# Altium schematic sheet v6_io_34_35_36_37_38.SchDoc: Virtex-6 IO Banks 34, 35,36,37 & 38
size A3; Date: DO NOT USE, RATHER USE PROJ OPTIONS; DrawnBy: DO NOT USE, RATHER USE PROJ OPTIONS; Engineer: DO NOT USE, RATHER USE PROJ OPTIONS; Organization: DO NOT USE, RATHER USE PROJ OPTIONS; DocumentNumber: DO NOT USE, RATHER USE PROJ OPTIONS; Revision: DO NOT USE, RATHER USE PROJ OPTIONS; SheetNumber: 17; SheetTotal: 27; SCH_Sheet_Filename: v6_io_34_35_36_37_38.SchDoc; CurrentTime: DO NOT USE, RATHER USE PROJ OPTIONS; Time: DO NOT USE, RATHER USE PROJ OPTIONS; DocumentFullPathAndName: DO NOT USE, RATHER USE PROJ OPTIONS; DocumentName: DO NOT USE, RATHER USE PROJ OPTIONS; ModifiedDate: DO NOT USE, RATHER USE PROJ OPTIONS; ImagePath: DO NOT USE, RATHER USE PROJ OPTIONS
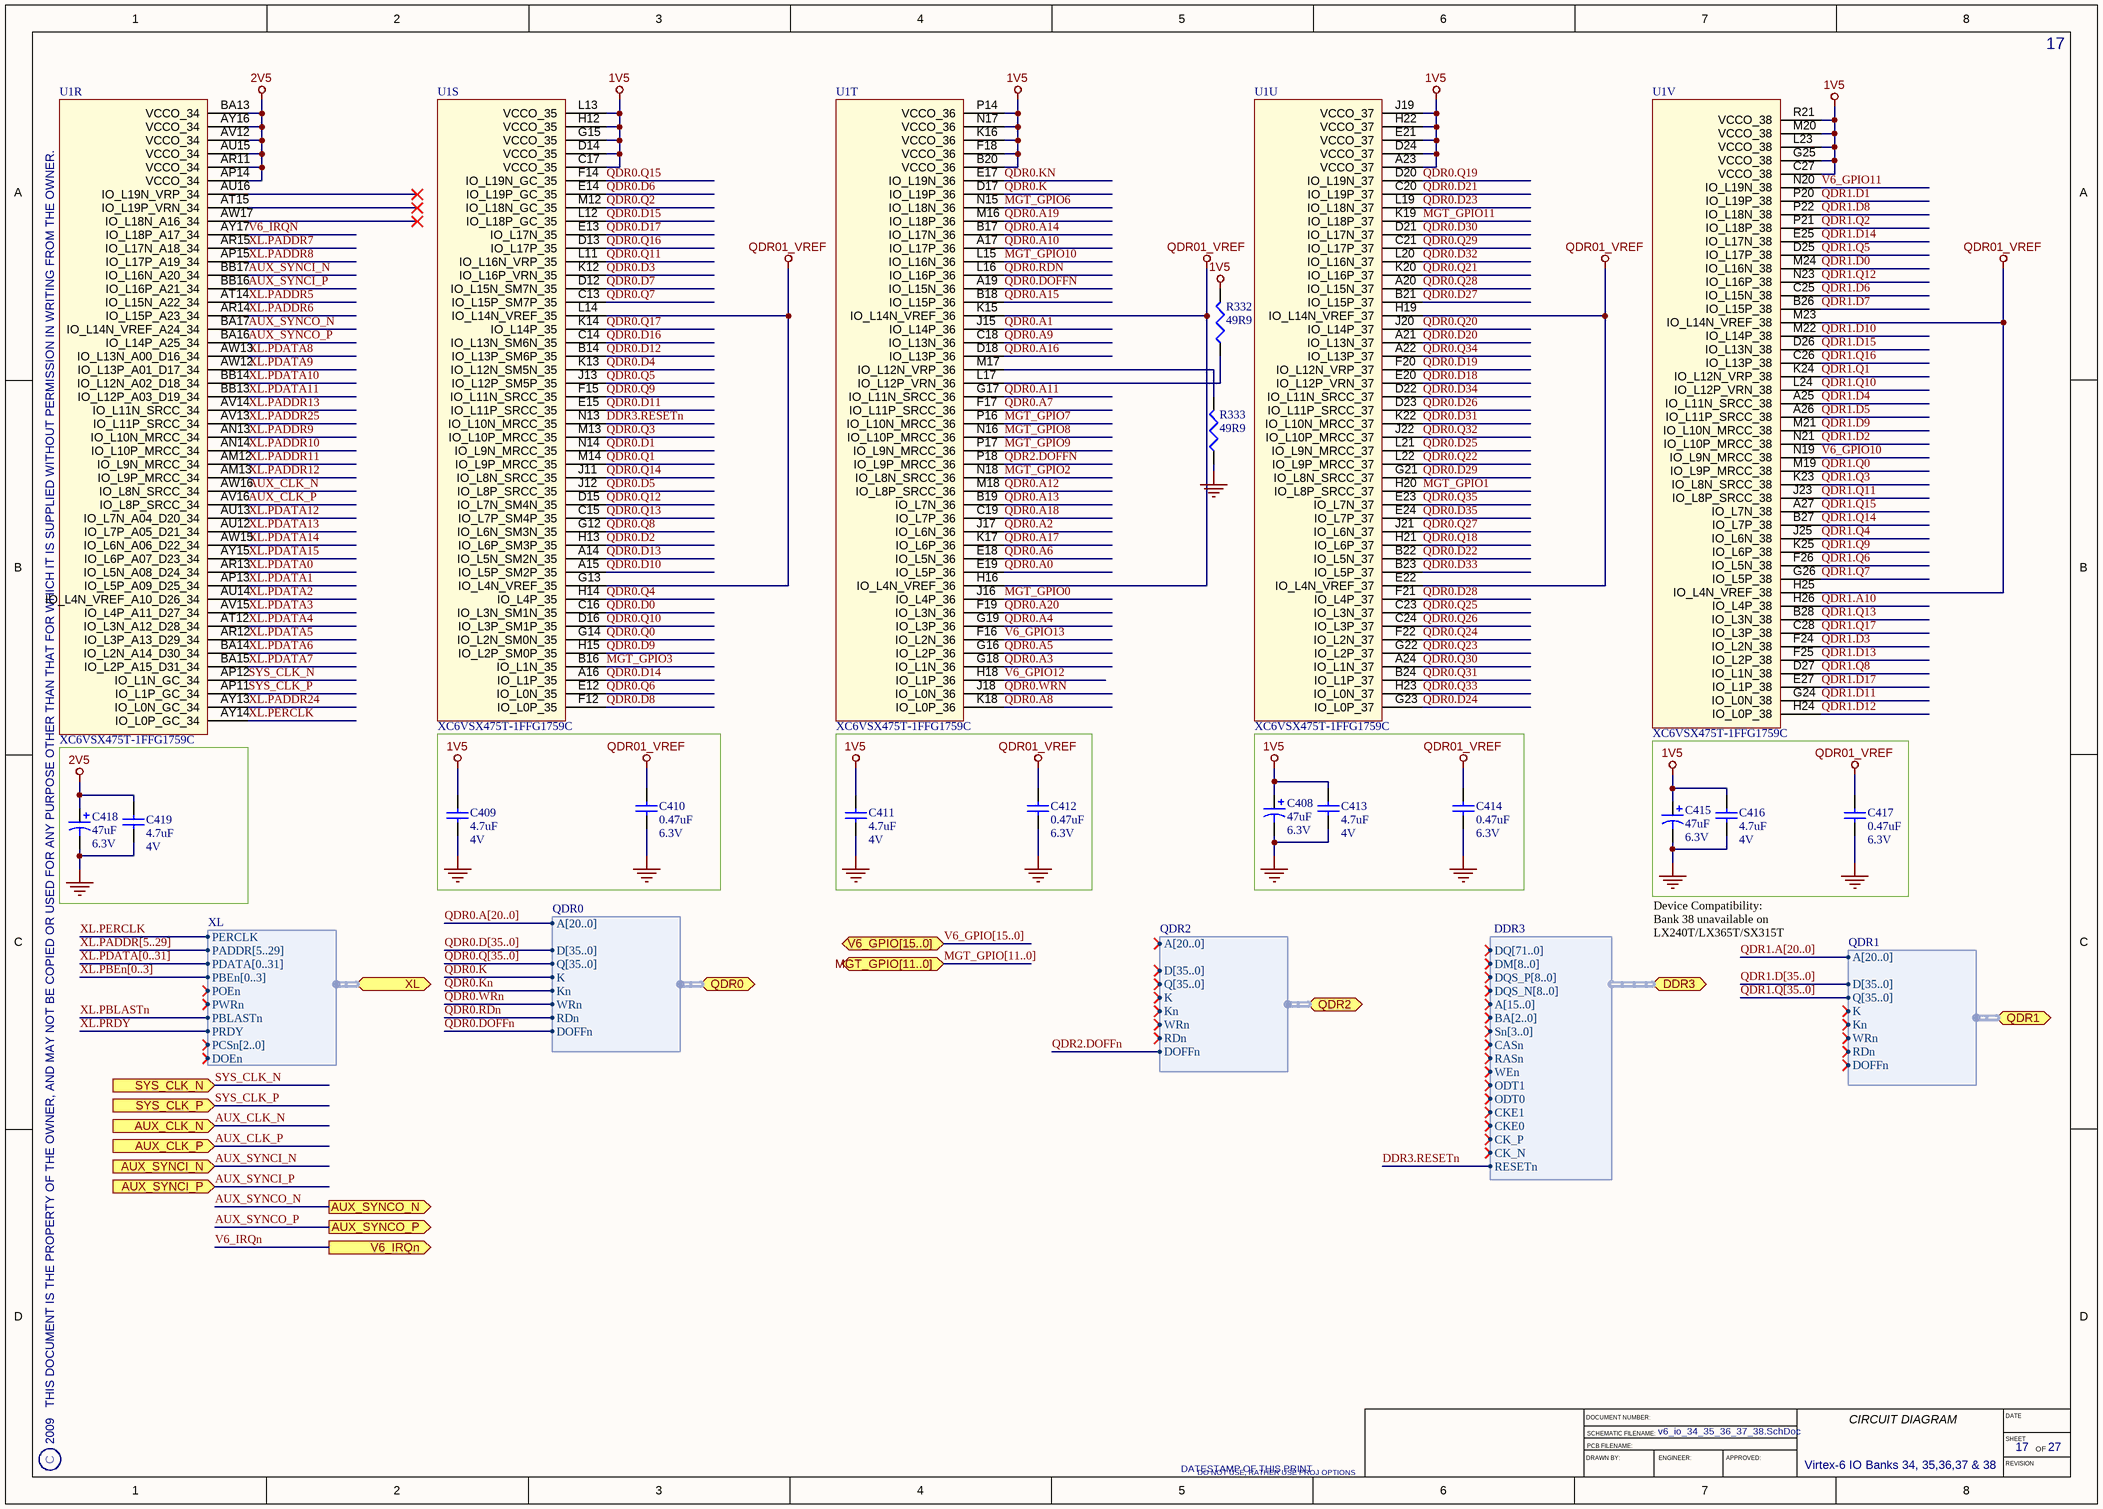
[diagram p0: v6_io_34_35_36_37_38.SchDoc]

## Parts
C408  Rating: 6.3V  [CAPMP3528X120L]  (hidden comment: 47uF)
C409  Rating: 4V  [CAPC1005X60L]  (hidden comment: 4.7uF)
C410  Rating: 6.3V  [CAPC1005X55L]  (hidden comment: 0.47uF)
C411  Rating: 4V  [CAPC1005X60L]  (hidden comment: 4.7uF)
C412  Rating: 6.3V  [CAPC1005X55L]  (hidden comment: 0.47uF)
C413  Rating: 4V  [CAPC1005X60L]  (hidden comment: 4.7uF)
C414  Rating: 6.3V  [CAPC1005X55L]  (hidden comment: 0.47uF)
C415  Rating: 6.3V  [CAPMP3528X120L]  (hidden comment: 47uF)
C416  Rating: 4V  [CAPC1005X60L]  (hidden comment: 4.7uF)
C417  Rating: 6.3V  [CAPC1005X55L]  (hidden comment: 0.47uF)
C418  Rating: 6.3V  [CAPMP3528X120L]  (hidden comment: 47uF)
C419  Rating: 4V  [CAPC1005X60L]  (hidden comment: 4.7uF)
R332  49R9  [RESC1005X40L]
R333  49R9  [RESC1005X40L]
U1  XC6VSX475T-1FFG1759C  [FFG1759]  (parts R,S,T,U,V of 39)

## Ports
AUX_CLK_N (in), AUX_CLK_P (in), AUX_SYNCI_N (in), AUX_SYNCI_P (in), AUX_SYNCO_N (out), AUX_SYNCO_P (out), DDR3 (harness DDR3), MGT_GPIO[11..0] (bidir), QDR0 (harness QDR0), QDR1 (harness QDR1), QDR2 (harness QDR2), SYS_CLK_N (in), SYS_CLK_P (in), V6_GPIO[15..0] (bidir), V6_IRQn (out), XL (harness XL)

## Harnesses
DDR3: DQ[71..0], DM[8..0], DQS_P[8..0], DQS_N[8..0], A[15..0], BA[2..0], Sn[3..0], CASn, RASn, WEn, ODT1, ODT0, CKE1, CKE0, CK_P, CK_N, RESETn
QDR0: A[20..0], D[35..0], Q[35..0], K, Kn, WRn, RDn, DOFFn
QDR2: A[20..0], D[35..0], Q[35..0], K, Kn, WRn, RDn, DOFFn
QDR1: A[20..0], D[35..0], Q[35..0], K, Kn, WRn, RDn, DOFFn
XL: PERCLK, PADDR[5..29], PDATA[0..31], PBEn[0..3], POEn, PWRn, PBLASTn, PRDY, PCSn[2..0], DOEn

## Nets
1V5: C408.1 C409.2 C411.2 C413.2 C415.1 C416.2 R332.2 U1.A23(VCCO_37) U1.B20(VCCO_36) U1.C17(VCCO_35) U1.C27(VCCO_38) U1.D14(VCCO_35) U1.D24(VCCO_37) U1.E21(VCCO_37) U1.F18(VCCO_36) U1.G15(VCCO_35) U1.G25(VCCO_38) U1.H12(VCCO_35) U1.H22(VCCO_37) U1.J19(VCCO_37) U1.K16(VCCO_36) U1.L13(VCCO_35) U1.L23(VCCO_38) U1.M20(VCCO_38) U1.N17(VCCO_36) U1.P14(VCCO_36) U1.R21(VCCO_38)
2V5: C418.1 C419.2 U1.AP14(VCCO_34) U1.AR11(VCCO_34) U1.AU15(VCCO_34) U1.AV12(VCCO_34) U1.AY16(VCCO_34) U1.BA13(VCCO_34)
GND: C408.2 C409.1 C410.1 C411.1 C412.1 C413.1 C414.1 C415.2 C416.1 C417.1 C418.2 C419.1 R333.1
QDR01_VREF: C410.2 C412.2 C414.2 C417.2 U1.E22(IO_L4N_VREF_37) U1.G13(IO_L4N_VREF_35) U1.H16(IO_L4N_VREF_36) U1.H19(IO_L14N_VREF_37) U1.H25(IO_L4N_VREF_38) U1.K15(IO_L14N_VREF_36) U1.L14(IO_L14N_VREF_35) U1.M23(IO_L14N_VREF_38)
AUX_CLK_N: U1.AW16(IO_L8N_SRCC_34) ; port AUX_CLK_N
AUX_CLK_P: U1.AV16(IO_L8P_SRCC_34) ; port AUX_CLK_P
AUX_SYNCI_N: U1.BB17(IO_L16N_A20_34) ; port AUX_SYNCI_N
AUX_SYNCI_P: U1.BB16(IO_L16P_A21_34) ; port AUX_SYNCI_P
AUX_SYNCO_N: U1.BA17(IO_L14N_VREF_A24_34) ; port AUX_SYNCO_N
AUX_SYNCO_P: U1.BA16(IO_L14P_A25_34) ; port AUX_SYNCO_P
DDR3.RESETn: U1.N13(IO_L10N_MRCC_35) ; port DDR3.RESETn
MGT_GPIO0: U1.J16(IO_L4P_36)
MGT_GPIO1: U1.H20(IO_L8P_SRCC_37)
MGT_GPIO2: U1.N18(IO_L8N_SRCC_36)
MGT_GPIO3: U1.B16(IO_L1N_35)
MGT_GPIO6: U1.N15(IO_L18N_36)
MGT_GPIO7: U1.P16(IO_L10N_MRCC_36)
MGT_GPIO8: U1.N16(IO_L10P_MRCC_36)
MGT_GPIO9: U1.P17(IO_L9N_MRCC_36)
MGT_GPIO10: U1.L15(IO_L16N_36)
MGT_GPIO11: U1.K19(IO_L18P_37)
QDR0.A0: U1.E19(IO_L5P_36)
QDR0.A1: U1.J15(IO_L14P_36)
QDR0.A2: U1.J17(IO_L6N_36)
QDR0.A3: U1.G18(IO_L1N_36)
QDR0.A4: U1.G19(IO_L3P_36)
QDR0.A5: U1.G16(IO_L2P_36)
QDR0.A6: U1.E18(IO_L5N_36)
QDR0.A7: U1.F17(IO_L11P_SRCC_36)
QDR0.A8: U1.K18(IO_L0P_36)
QDR0.A9: U1.C18(IO_L13N_36)
QDR0.A10: U1.A17(IO_L17P_36)
QDR0.A11: U1.G17(IO_L11N_SRCC_36)
QDR0.A12: U1.M18(IO_L8P_SRCC_36)
QDR0.A13: U1.B19(IO_L7N_36)
QDR0.A14: U1.B17(IO_L17N_36)
QDR0.A15: U1.B18(IO_L15P_36)
QDR0.A16: U1.D18(IO_L13P_36)
QDR0.A17: U1.K17(IO_L6P_36)
QDR0.A18: U1.C19(IO_L7P_36)
QDR0.A19: U1.M16(IO_L18P_36)
QDR0.A20: U1.F19(IO_L3N_36)
QDR0.D0: U1.C16(IO_L3N_SM1N_35)
QDR0.D1: U1.N14(IO_L9N_MRCC_35)
QDR0.D2: U1.H13(IO_L6P_SM3P_35)
QDR0.D3: U1.K12(IO_L16P_VRN_35)
QDR0.D4: U1.K13(IO_L12N_SM5N_35)
QDR0.D5: U1.J12(IO_L8P_SRCC_35)
QDR0.D6: U1.E14(IO_L19P_GC_35)
QDR0.D7: U1.D12(IO_L15N_SM7N_35)
QDR0.D8: U1.F12(IO_L0P_35)
QDR0.D9: U1.H15(IO_L2P_SM0P_35)
QDR0.D10: U1.A15(IO_L5P_SM2P_35)
QDR0.D11: U1.E15(IO_L11P_SRCC_35)
QDR0.D12: U1.B14(IO_L13P_SM6P_35)
QDR0.D13: U1.A14(IO_L5N_SM2N_35)
QDR0.D14: U1.A16(IO_L1P_35)
QDR0.D15: U1.L12(IO_L18P_GC_35)
QDR0.D16: U1.C14(IO_L13N_SM6N_35)
QDR0.D17: U1.E13(IO_L17N_35)
QDR0.D18: U1.E20(IO_L12P_VRN_37)
QDR0.D19: U1.F20(IO_L12N_VRP_37)
QDR0.D20: U1.A21(IO_L13N_37)
QDR0.D21: U1.C20(IO_L19P_37)
QDR0.D22: U1.B22(IO_L5N_37)
QDR0.D23: U1.L19(IO_L18N_37)
QDR0.D24: U1.G23(IO_L0P_37)
QDR0.D25: U1.L21(IO_L9N_MRCC_37)
QDR0.D26: U1.D23(IO_L11P_SRCC_37)
QDR0.D27: U1.B21(IO_L15P_37)
QDR0.D28: U1.F21(IO_L4P_37)
QDR0.D29: U1.G21(IO_L8N_SRCC_37)
QDR0.D30: U1.D21(IO_L17N_37)
QDR0.D31: U1.K22(IO_L10N_MRCC_37)
QDR0.D32: U1.L20(IO_L16N_37)
QDR0.D33: U1.B23(IO_L5P_37)
QDR0.D34: U1.D22(IO_L11N_SRCC_37)
QDR0.D35: U1.E24(IO_L7P_37)
QDR0.DOFFn: U1.A19(IO_L15N_36) ; port QDR0.DOFFn
QDR0.K: U1.D17(IO_L19P_36) ; port QDR0.K
QDR0.Kn: U1.E17(IO_L19N_36) ; port QDR0.Kn
QDR0.Q0: U1.G14(IO_L2N_SM0N_35)
QDR0.Q1: U1.M14(IO_L9P_MRCC_35)
QDR0.Q2: U1.M12(IO_L18N_GC_35)
QDR0.Q3: U1.M13(IO_L10P_MRCC_35)
QDR0.Q4: U1.H14(IO_L4P_35)
QDR0.Q5: U1.J13(IO_L12P_SM5P_35)
QDR0.Q6: U1.E12(IO_L0N_35)
QDR0.Q7: U1.C13(IO_L15P_SM7P_35)
QDR0.Q8: U1.G12(IO_L6N_SM3N_35)
QDR0.Q9: U1.F15(IO_L11N_SRCC_35)
QDR0.Q10: U1.D16(IO_L3P_SM1P_35)
QDR0.Q11: U1.L11(IO_L16N_VRP_35)
QDR0.Q12: U1.D15(IO_L7N_SM4N_35)
QDR0.Q13: U1.C15(IO_L7P_SM4P_35)
QDR0.Q14: U1.J11(IO_L8N_SRCC_35)
QDR0.Q15: U1.F14(IO_L19N_GC_35)
QDR0.Q16: U1.D13(IO_L17P_35)
QDR0.Q17: U1.K14(IO_L14P_35)
QDR0.Q18: U1.H21(IO_L6P_37)
QDR0.Q19: U1.D20(IO_L19N_37)
QDR0.Q20: U1.J20(IO_L14P_37)
QDR0.Q21: U1.K20(IO_L16P_37)
QDR0.Q22: U1.L22(IO_L9P_MRCC_37)
QDR0.Q23: U1.G22(IO_L2P_37)
QDR0.Q24: U1.F22(IO_L2N_37)
QDR0.Q25: U1.C23(IO_L3N_37)
QDR0.Q26: U1.C24(IO_L3P_37)
QDR0.Q27: U1.J21(IO_L6N_37)
QDR0.Q28: U1.A20(IO_L15N_37)
QDR0.Q29: U1.C21(IO_L17P_37)
QDR0.Q30: U1.A24(IO_L1N_37)
QDR0.Q31: U1.B24(IO_L1P_37)
QDR0.Q32: U1.J22(IO_L10P_MRCC_37)
QDR0.Q33: U1.H23(IO_L0N_37)
QDR0.Q34: U1.A22(IO_L13P_37)
QDR0.Q35: U1.E23(IO_L7N_37)
QDR0.RDn: U1.L16(IO_L16P_36) ; port QDR0.RDn
QDR0.WRn: U1.J18(IO_L0N_36) ; port QDR0.WRn
QDR1.A10: U1.H26(IO_L4P_38)
QDR1.D0: U1.M24(IO_L16N_38)
QDR1.D1: U1.P20(IO_L19P_38)
QDR1.D2: U1.N21(IO_L10P_MRCC_38)
QDR1.D3: U1.F24(IO_L2N_38)
QDR1.D4: U1.A25(IO_L11N_SRCC_38)
QDR1.D5: U1.A26(IO_L11P_SRCC_38)
QDR1.D6: U1.C25(IO_L15N_38)
QDR1.D7: U1.B26(IO_L15P_38)
QDR1.D8: U1.P22(IO_L18N_38)
QDR1.D9: U1.M21(IO_L10N_MRCC_38)
QDR1.D10: U1.M22(IO_L14P_38)
QDR1.D11: U1.G24(IO_L0N_38)
QDR1.D12: U1.H24(IO_L0P_38)
QDR1.D13: U1.F25(IO_L2P_38)
QDR1.D14: U1.E25(IO_L17N_38)
QDR1.D15: U1.D26(IO_L13N_38)
QDR1.D17: U1.E27(IO_L1P_38)
QDR1.Q0: U1.M19(IO_L9P_MRCC_38)
QDR1.Q1: U1.K24(IO_L12N_VRP_38)
QDR1.Q2: U1.P21(IO_L18P_38)
QDR1.Q3: U1.K23(IO_L8N_SRCC_38)
QDR1.Q4: U1.J25(IO_L6N_38)
QDR1.Q5: U1.D25(IO_L17P_38)
QDR1.Q6: U1.F26(IO_L5N_38)
QDR1.Q7: U1.G26(IO_L5P_38)
QDR1.Q8: U1.D27(IO_L1N_38)
QDR1.Q9: U1.K25(IO_L6P_38)
QDR1.Q10: U1.L24(IO_L12P_VRN_38)
QDR1.Q11: U1.J23(IO_L8P_SRCC_38)
QDR1.Q12: U1.N23(IO_L16P_38)
QDR1.Q13: U1.B28(IO_L3N_38)
QDR1.Q14: U1.B27(IO_L7P_38)
QDR1.Q15: U1.A27(IO_L7N_38)
QDR1.Q16: U1.C26(IO_L13P_38)
QDR1.Q17: U1.C28(IO_L3P_38)
QDR2.DOFFn: U1.P18(IO_L9P_MRCC_36) ; port QDR2.DOFFn
SYS_CLK_N: U1.AP12(IO_L1N_GC_34) ; port SYS_CLK_N
SYS_CLK_P: U1.AP11(IO_L1P_GC_34) ; port SYS_CLK_P
V6_GPIO10: U1.N19(IO_L9N_MRCC_38)
V6_GPIO11: U1.N20(IO_L19N_38)
V6_GPIO12: U1.H18(IO_L1P_36)
V6_GPIO13: U1.F16(IO_L2N_36)
V6_IRQn: U1.AY17(IO_L18P_A17_34) ; port V6_IRQn
XL.PADDR5: U1.AT14(IO_L15N_A22_34)
XL.PADDR6: U1.AR14(IO_L15P_A23_34)
XL.PADDR7: U1.AR15(IO_L17N_A18_34)
XL.PADDR8: U1.AP15(IO_L17P_A19_34)
XL.PADDR9: U1.AN13(IO_L10N_MRCC_34)
XL.PADDR10: U1.AN14(IO_L10P_MRCC_34)
XL.PADDR11: U1.AM12(IO_L9N_MRCC_34)
XL.PADDR12: U1.AM13(IO_L9P_MRCC_34)
XL.PADDR13: U1.AV14(IO_L11N_SRCC_34)
XL.PADDR24: U1.AY13(IO_L0N_GC_34)
XL.PADDR25: U1.AV13(IO_L11P_SRCC_34)
XL.PBLASTn: port XL.PBLASTn
XL.PDATA0: U1.AR13(IO_L5N_A08_D24_34)
XL.PDATA1: U1.AP13(IO_L5P_A09_D25_34)
XL.PDATA2: U1.AU14(IO_L4N_VREF_A10_D26_34)
XL.PDATA3: U1.AV15(IO_L4P_A11_D27_34)
XL.PDATA4: U1.AT12(IO_L3N_A12_D28_34)
XL.PDATA5: U1.AR12(IO_L3P_A13_D29_34)
XL.PDATA6: U1.BA14(IO_L2N_A14_D30_34)
XL.PDATA7: U1.BA15(IO_L2P_A15_D31_34)
XL.PDATA8: U1.AW13(IO_L13N_A00_D16_34)
XL.PDATA9: U1.AW12(IO_L13P_A01_D17_34)
XL.PDATA10: U1.BB14(IO_L12N_A02_D18_34)
XL.PDATA11: U1.BB13(IO_L12P_A03_D19_34)
XL.PDATA12: U1.AU13(IO_L7N_A04_D20_34)
XL.PDATA13: U1.AU12(IO_L7P_A05_D21_34)
XL.PDATA14: U1.AW15(IO_L6N_A06_D22_34)
XL.PDATA15: U1.AY15(IO_L6P_A07_D23_34)
XL.PERCLK: U1.AY14(IO_L0P_GC_34) ; port XL.PERCLK
XL.PRDY: port XL.PRDY
NetR332_1: R332.1 U1.L17(IO_L12P_VRN_36)
NetR333_2: R333.2 U1.M17(IO_L12N_VRP_36)

Not connected (* = marked no-connect by the designer): U1 AT15(IO_L19P_VRN_34)* AU16(IO_L19N_VRP_34)* AW17(IO_L18N_A16_34)*

## Buses and harness runs
bus MGT_GPIO[11..0] = port MGT_GPIO[11..0]
bus QDR0.A[20..0]
bus QDR0.D[35..0]
bus QDR0.Q[35..0]
bus QDR1.A[20..0]
bus QDR1.D[35..0]
bus QDR1.Q[35..0]
bus V6_GPIO[15..0] = port V6_GPIO[15..0]
bus XL.PADDR[5..29]
bus XL.PBEn[0..3]
bus XL.PDATA[0..31]

## Notes on the sheet
- Device Compatibility:
  Bank 38 unavailable on LX240T/LX365T/SX315T
- 2009   THIS DOCUMENT IS THE PROPERTY OF THE OWNER, AND MAY NOT BE COPIED OR USED FOR ANY PURPOSE OTHER THAN THAT FOR WHICH IT IS SUPPLIED WITHOUT PERMISSION IN WRITING FROM THE OWNER.
- C
- DATESTAMP OF THIS PRINT
- DRAWN BY:
- DOCUMENT NUMBER:
- SCHEMATIC FILENAME:
- PCB FILENAME:
- ENGINEER:
- APPROVED:
- CIRCUIT DIAGRAM
- DATE
- SHEET
- REVISION
- OF

## Library data of the parts
C408 C415 C418 = CAP-TAN-1: 47uF, Conductive Polymer Chip Capacitor; Manufacturer: KEMET; PartNum: T520T476M006ATE070; Tolerance: 20%; ESR: 0.07; POD number: CAP-TAN-1; Value: 47uF; RoHS: Y; Sort Value: 47; Category: Capacitors; Subcategory: Tantalum
C409 C411 C413 C416 C419 = CAP-CER-11: 4.7uF, Ceramic Capacitor; Manufacturer: MURATA; PartNum: AMK105BJ475MV-F; Tolerance: 20%; Dielectric: X5R; POD number: CAP-CER-11; Value: 4.7uF; RoHS: Y; Sort Value: 4.7; Category: Capacitors; Subcategory: Ceramic
C410 C412 C414 C417 = CAP-CER-7: 0.47uF, Ceramic Capacitor; Manufacturer: MURATA; PartNum: GRM155R60J474KE19; Tolerance: 10%; Dielectric: X5R; POD number: CAP-CER-7; Value: 0.47uF; RoHS: Y; Sort Value: 0.47; Category: Capacitors; Subcategory: Ceramic
R332 R333 = RES-TF-10: 49R9, 1.1mm x 0.5mm, Thick Film Resistor; Manufacturer: ROYALOHM; PartNum: 0402WGF499JT1E; Tolerance: 1%; Rating: 0.0625W; POD number: RES-TF-10; Value: 49R9; Sort Value: 49.9; Category: Resistors; Subcategory: ThickFilm; HelpURL: *.pdf
U1 = IC-PLD-0: Virtex-6 475SXT 1760-pin FPGA; Manufacturer: Xilinx; POD number: IC-PLD-0; PartNum: XC6VSX475T-1FFG1759C; RoHS: Y; Category: IC; Subcategory: PLD